# EAGLE design coyoho-camera (EAGLE 5.10)
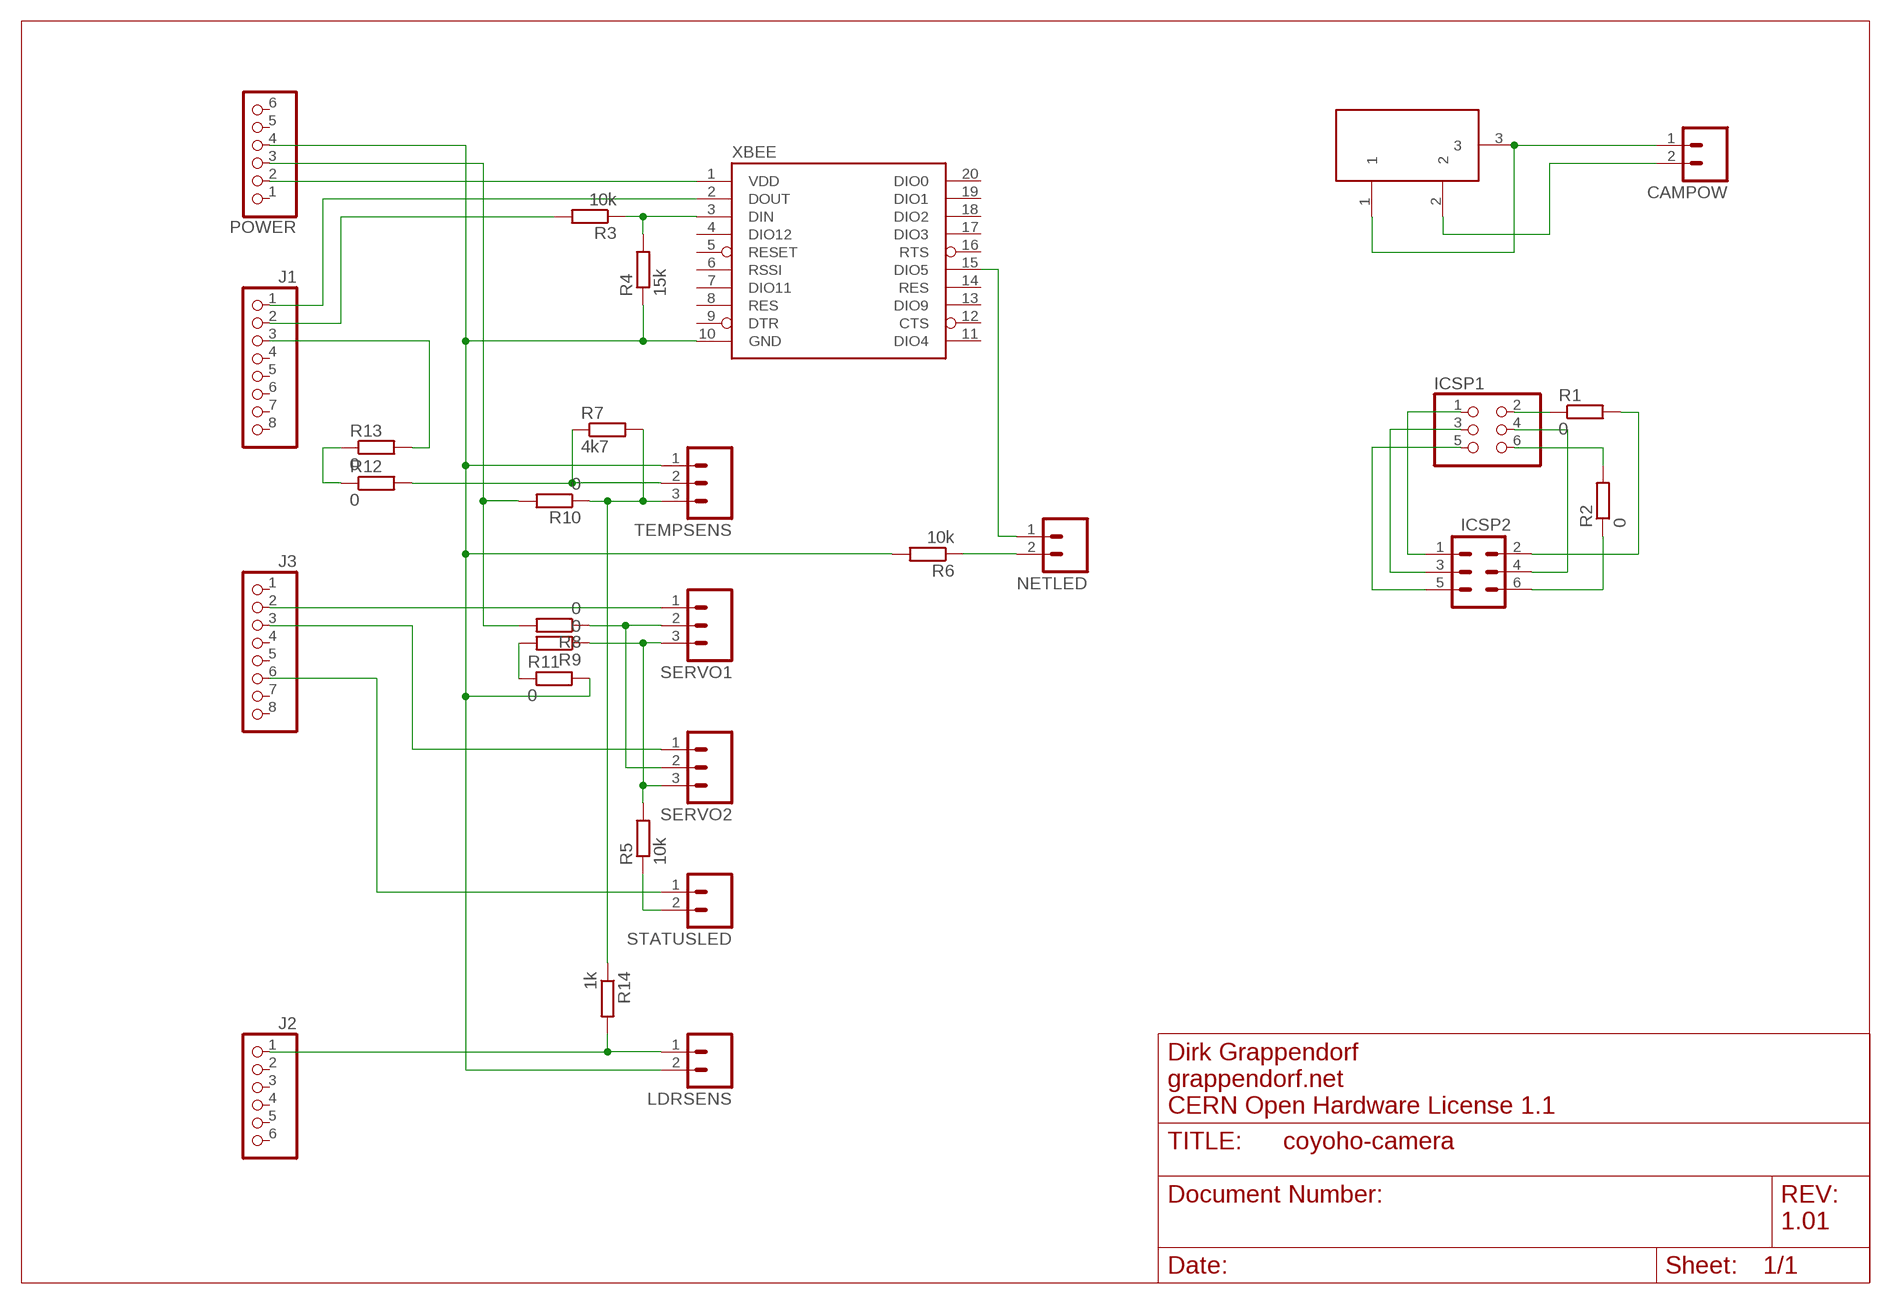
[diagram p0: schematic, sheet 1]

## Parts
CAMPOW  M02-74099  [74099-02]
ICSP1  PINHD-2X3  [2X03]
ICSP2  M03X2SHD_SMD  [2X5-SMD]
J1  PINHD-1X8  [1X08]
J2  PINHD-1X6  [1X06]
J3  PINHD-1X8  [1X08]
LDRSENS  M02-74099  [74099-02]
NETLED  M02-74099  [74099-02]
POWER  PINHD-1X6  [1X06]
R1  0  R-EU_M1206  [M1206]
R2  0  R-EU_M1206  [M1206]
R3  10k  R-EU_R1206  [R1206]
R4  15k  R-EU_R1206  [R1206]
R5  10k  R-EU_R1206  [R1206]
R6  10k  R-EU_R1206  [R1206]
R7  4k7  R-EU_R1206  [R1206]
R8  0  R-EU_M1206  [M1206]
R9  0  R-EU_M1206  [M1206]
R10  0  R-EU_M1206  [M1206]
R11  0  R-EU_M1206  [M1206]
R12  0  R-EU_M1206  [M1206]
R13  0  R-EU_M1206  [M1206]
R14  1k  R-EU_R1206  [R1206]
SERVO1  M03-74099  [74099-03]
SERVO2  M03-74099  [74099-03]
STATUSLED  M02-74099  [74099-02]
TEMPSENS  M03-74099  [74099-03]
X2  DC21MMX  [DC-21MM]
XBEE  XBEE-1B3  [XBEE-SMD]

## Nets
N$1: ICSP1.1 ICSP2.1
N$2: CAMPOW.2 X2.2
N$3: ICSP1.3 ICSP2.3
N$4: ICSP1.5 ICSP2.5
N$5: ICSP1.2 R1.1
N$6: ICSP1.4 ICSP2.4
N$7: ICSP1.6 R2.2
N$8: ICSP2.2 R1.2
N$9: ICSP2.6 R2.1
N$10: CAMPOW.1 X2.1 X2.3
N$11: J3.2 SERVO1.1
N$12: J3.3 SERVO2.1
N$13: POWER.3 R8.2 R10.2
N$14: LDRSENS.2 POWER.4 R4.1 R6.2 R11.2 TEMPSENS.1 XBEE.10(GND)
N$15: POWER.2 XBEE.1(VDD)
N$16: R3.1 R4.2 XBEE.3(DIN)
N$17: J1.2 R3.2
N$18: J1.1 XBEE.2(DOUT)
N$19: R5.1 STATUSLED.2
N$20: J3.6 STATUSLED.1
N$21: NETLED.2 R6.1
N$22: NETLED.1 XBEE.15(DIO5)
N$23: J1.3 R13.2
N$24: R5.2 R9.1 SERVO1.3 SERVO2.3
N$27: R8.1 SERVO1.2 SERVO2.2
N$28: R7.2 R10.1 R14.1 TEMPSENS.3
N$29: R9.2 R11.1
N$30: R12.1 R13.1
N$31: R7.1 R12.2 TEMPSENS.2
N$32: J2.1 LDRSENS.1 R14.2
Unconnected: J1.4 J1.5 J1.6 J1.7 J1.8 J2.2 J2.3 J2.4 J2.5 J2.6 J3.1 J3.4 J3.5 J3.7 J3.8 POWER.1 POWER.5 POWER.6 XBEE.4(DIO12) XBEE.5(RESET) XBEE.6(RSSI) XBEE.7(DIO11) XBEE.8(RES) XBEE.9(DTR) XBEE.11(DIO4) XBEE.12(CTS) XBEE.13(DIO9) XBEE.14(RES) XBEE.16(RTS) XBEE.17(DIO3) XBEE.18(DIO2) XBEE.19(DIO1) XBEE.20(DIO0)

## Notes on the sheet
- Dirk Grappendorf
- grappendorf.net
- CERN Open Hardware License 1.1
- 1.01

## Library data of the parts
CAMPOW LDRSENS NETLED STATUSLED = grapelabs:M02: CONNECTOR wire to board 2.54 mm (0.100") pitch header
ICSP1 = pinhead:PINHD-2X3: PIN HEADER
ICSP2 = grapelabs:M03X2: Header 5x2 Standard 10-pin dual row 0.1" header. Commonly used with AVR-ISP. Use with Spark Fun Electronics SKU: PRT-00778
J1 J3 = pinhead:PINHD-1X8: PIN HEADER
J2 POWER = pinhead:PINHD-1X6: PIN HEADER
R1-R14 = rcl:R-EU_: RESISTOR, European symbol
SERVO1 SERVO2 TEMPSENS = grapelabs:M03: CONNECTOR wire to board 2.54 mm (0.100") pitch header
X2 = powersupply:DC21MM
XBEE = SparkFun:XBEE-1

## Net classes
0 default: width 0.254 mm, drill 0.305 mm, clearance 0.152 mm
1 power: width 0.61 mm, drill 0.508 mm, clearance 0.152 mm
2 gnd: width 0.305 mm, drill 0.508 mm, clearance 0.152 mm
3 usbvcc: width 0.508 mm, drill 0.508 mm, clearance 0.152 mm
4 aref: width 0.406 mm

## Board
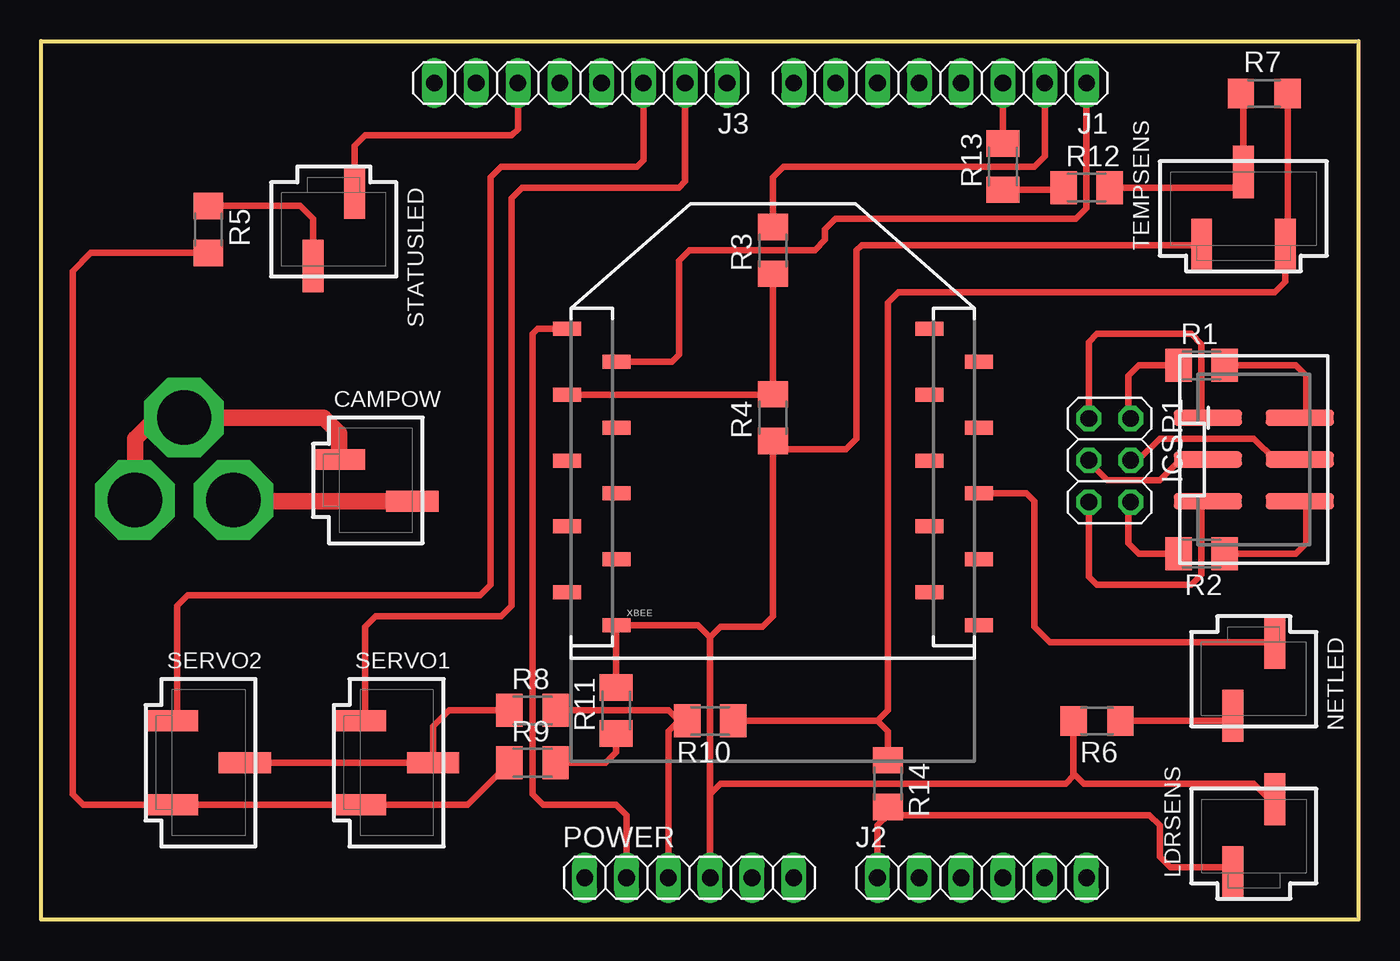
[diagram p1: board, top side]
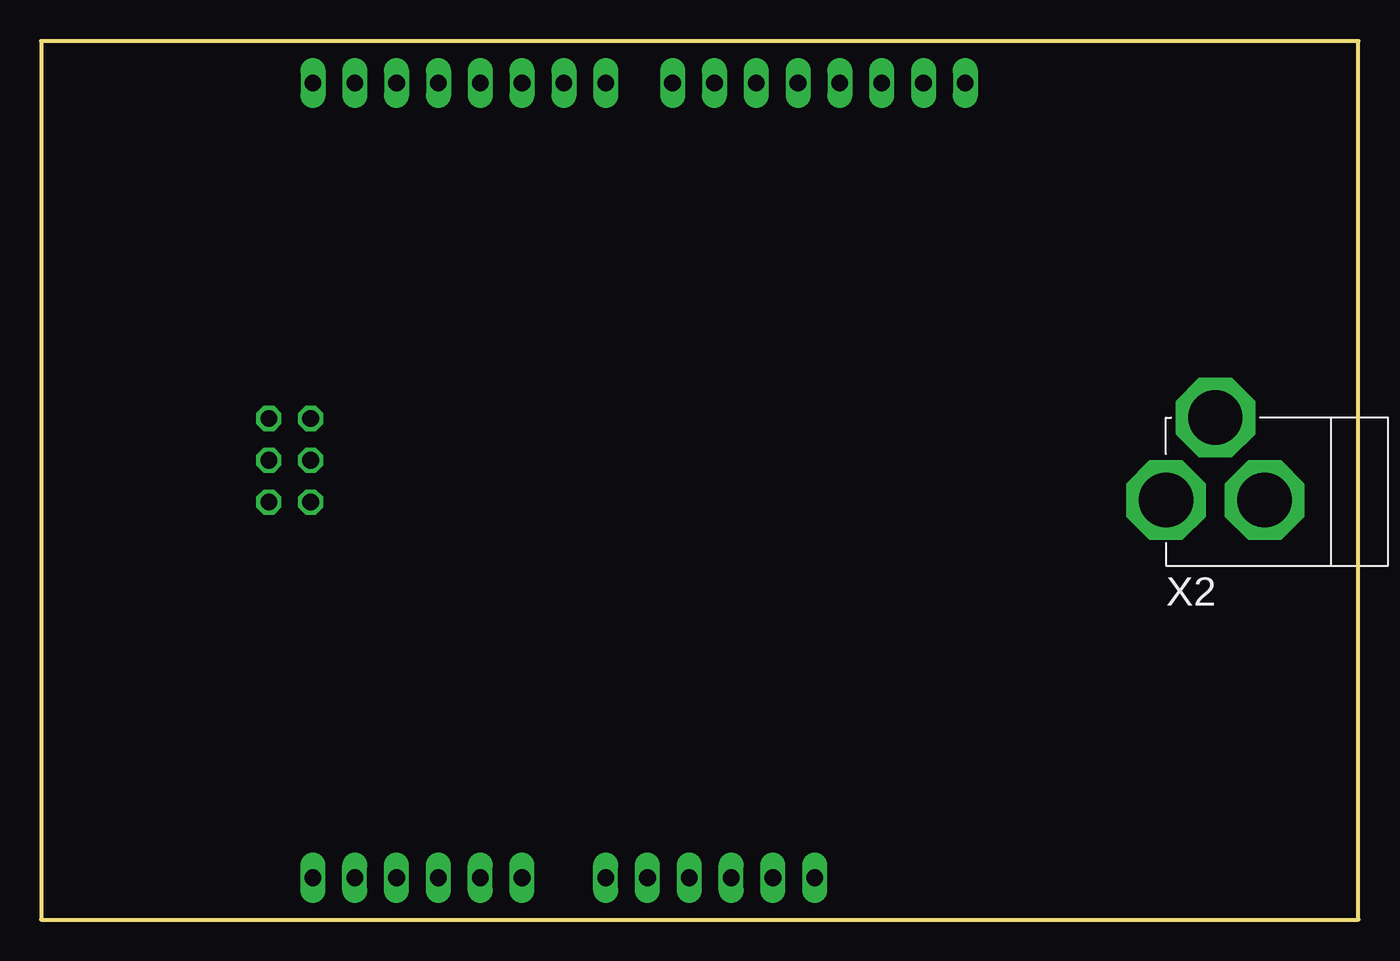
[diagram p2: board, bottom side, seen from below]

Size 80.01 x 53.34 mm. Coordinates in mm from the lower left corner, seen from the top.
Outline: 0,53.34 80.01,53.34 80.01,0 0,0 0,53.34
Copper layers (1*16): Top 0.035mm / dielectric 1.5mm / Bottom 0.035mm
Design rules "default *": minimum track width 6mil, minimum drill 12mil, track to track 6mil, track to pad 6mil, pad to pad 6mil, via to via 6mil, smd to smd 6mil, copper to edge 30mil, drill to drill 6mil, minimum pad ring 10mil, minimum via ring 10mil, stop-mask expansion 4mil, vias tented up to drill 0mil, thermal gap 10mil

### Footprints (pad centres in the part's own frame; a part is rotated, then mirrored left to right if it is on the bottom)
74099-02 = smd 1.27 x 3.175: 1 -2.54,-2.223; 2 0,2.223
2X03 = drill 1.016 octagon: 1 -2.54,-1.27; 2 -2.54,1.27; 3 0,-1.27; 4 0,1.27; 5 2.54,-1.27; 6 2.54,1.27
2X5-SMD = smd 4.15 x 1: 1 -2.794,2.54; 2 2.794,2.54; 3 -2.794,0; 4 2.794,0; 5 -2.794,-2.54; 6 2.794,-2.54
1X08 = drill 1.016 long: 1 -8.89,0; 2 -6.35,0; 3 -3.81,0; 4 -1.27,0; 5 1.27,0; 6 3.81,0; 7 6.35,0; 8 8.89,0
1X06 = drill 1.016 long: 1 -6.35,0; 2 -3.81,0; 3 -1.27,0; 4 1.27,0; 5 3.81,0; 6 6.35,0
M1206 = smd 1.6 x 2: 1 -1.4,0; 2 1.4,0
R1206 = smd 1.6 x 1.803: 1 -1.422,0; 2 1.422,0
74099-03 = smd 1.27 x 3.175: 1 -2.54,-2.223; 2 0,2.223; 3 2.54,-2.223
DC-21MM = drill 3.302 pad 4.826 octagon: 1 -5.08,-3.353; 2 -0.076,-6.35; 3 -0.076,-0.356
XBEE-SMD = smd 1.7 x 0.85: 1 -12.5,20; 2 -9.5,18; 3 -12.5,16; 4 -9.5,14; 5 -12.5,12; 6 -9.5,10; 7 -12.5,8; 8 -9.5,6; 9 -12.5,4; 10 -9.5,2; 11 12.5,2; 12 9.5,4; 13 12.5,6; 14 9.5,8; 15 12.5,10; 16 9.5,12; 17 12.5,14; 18 9.5,16; 19 12.5,18; 20 9.5,20

### Placement (x,y rotation side)
CAMPOW  20.32,25.4 270 top
ICSP1  64.91,27.89 270 top
ICSP2  73.66,27.94 0 top
J1  54.61,50.8 180 top
J2  57.15,2.54 0 top
J3  32.77,50.8 180 top
LDRSENS  74.93,5.08 0 top
NETLED  72.39,14.61 180 top
POWER  39.37,2.54 0 top
R1  70.48,33.66 0 top
R2  70.48,22.23 180 top
R3  44.45,40.64 90 top
R4  44.45,30.48 90 top
R5  10.16,41.91 270 top
R6  64.14,12.06 180 top
R7  74.3,50.16 0 top
R8  29.84,12.7 0 top
R9  29.84,9.53 0 top
R10  40.64,12.06 180 top
R11  34.92,12.7 90 top
R12  63.5,44.45 0 top
R13  58.42,45.72 90 top
R14  51.44,8.26 270 top
SERVO1  21.59,9.53 270 top
SERVO2  10.16,9.53 270 top
STATUSLED  16.51,41.91 180 top
TEMPSENS  73.03,43.18 0 top
X2  5.33,25.4 270 bottom
XBEE  44.45,15.88 0 top

### Tracks (layer width: path | path; a pad name or v marks a point on that pad's centre or on a via)
N$1
  Top 0.406: ICSP1.1 63.64,35.06 64.14,35.56 69.85,35.56 70.48,34.92 70.48,30.86 ICSP2.1
N$2
  Top 1.016: CAMPOW.2 11.76,25.4 X2.2
N$3
  Top 0.406: ICSP1.3 63.64,27.8 64.77,26.67 67.94,26.67 69.22,27.94 ICSP2.3
N$4
  Top 0.406: ICSP1.5 63.64,20.82 64.14,20.32 69.85,20.32 70.48,20.95 70.48,25.02 ICSP2.5
N$5
  Top 0.406: R1.1 66.67,33.66 66.04,33.02 66.04,30.57 ICSP1.2
N$6
  Top 0.406: ICSP1.4 66.62,27.89 67.94,29.21 73.66,29.21 74.93,27.94 ICSP2.4
N$7
  Top 0.406: R2.2 66.67,22.23 66.04,22.86 66.04,25.21 ICSP1.6
N$8
  Top 0.406: R1.2 76.2,33.66 76.83,33.02 76.83,30.86 ICSP2.2
N$9
  Top 0.406: R2.1 76.2,22.23 76.83,22.86 76.83,25.02 ICSP2.6
N$10
  Top 1.016: X2.3 5.71,25.5 5.71,29.21 6.99,30.48 X2.1 17.14,30.48 18.1,29.53 CAMPOW.1
N$11
  Top 0.406: J3.2 39.12,44.83 38.73,44.45 29.21,44.45 28.57,43.81 28.57,19.05 27.94,18.41 20.32,18.41 19.68,17.78 19.68,12.38 SERVO1.1
N$12
  Top 0.406: J3.3 36.58,46.1 36.2,45.72 27.94,45.72 27.3,45.09 27.3,20.32 26.67,19.68 8.89,19.68 8.26,19.05 8.26,12.38 SERVO2.1
N$13
  Top 0.406: 38.73,12.06 R10.2 | 38.73,12.06 38.1,11.43 POWER.3 | R8.2 38.1,12.7 38.73,12.06
N$14
  Top 0.406: POWER.4 40.64,7.62 | 40.64,7.62 40.64,17.14 | 40.64,17.14 39.91,17.88 XBEE.10 34.92,17.21 R11.2 | 40.64,17.14 41.27,17.78 43.81,17.78 44.45,18.41 R4.1 44.6,28.57 48.9,28.57 49.53,29.21 49.53,40.64 49.85,40.96 TEMPSENS.1 | 40.64,7.62 41.27,8.26 62.23,8.26 62.71,8.74 62.71,8.89 | 62.71,9.68 R6.2 62.71,8.89 | LDRSENS.2 74.61,7.3 73.66,8.26 63.35,8.26 62.71,8.89
N$15
  Top 0.406: XBEE.1 30.16,35.88 29.84,35.56 29.84,7.62 30.48,6.99 34.92,6.99 35.56,6.35 POWER.2
N$16
  Top 0.406: XBEE.3 44.42,31.88 R4.2 R3.1
N$17
  Top 0.406: R3.2 44.45,45.09 45.09,45.72 60.33,45.72 60.96,46.35 J1.2
N$18
  Top 0.406: XBEE.2 38.32,33.88 38.73,34.29 38.73,40.01 39.37,40.64 46.99,40.64 47.62,41.27 47.62,41.91 48.26,42.55 62.87,42.55 63.5,43.18 J1.1
N$19
  Top 0.406: R5.1 15.72,43.33 16.51,42.55 STATUSLED.2
N$20
  Top 0.406: J3.6 28.96,48.01 28.57,47.62 19.68,47.62 19.05,46.99 STATUSLED.1
N$21
  Top 0.406: R6.1 72.07,12.06 NETLED.2
N$22
  Top 0.406: NETLED.1 61.28,16.83 60.33,17.78 60.33,25.4 59.85,25.88 XBEE.15
N$23
  Top 0.406: R13.2 J1.3
N$24
  Top 0.406: R9.1 25.91,6.99 SERVO1.3 SERVO2.3 2.54,6.99 1.91,7.62 1.91,39.37 3.02,40.49 R5.2
N$27
  Top 0.406: R8.1 24.77,12.7 23.81,11.75 SERVO1.2 SERVO2.2
N$28
  Top 0.406: 50.8,12.06 51.44,12.7 51.44,37.47 52.07,38.1 74.93,38.1 75.56,38.73 TEMPSENS.3 75.72,41.11 R7.2 | R10.1 50.8,12.06 | R14.1 51.44,11.43 50.8,12.06
N$29
  Top 0.406: R9.2 34.29,9.53 34.92,10.16 R11.1
N$30
  Top 0.406: R13.1 61.97,44.32 R12.1
N$31
  Top 0.406: TEMPSENS.2 72.71,45.09 | TEMPSENS.2 73.03,50.01 R7.1 | R12.2 73.03,44.45 TEMPSENS.2
N$32
  Top 0.406: 51.44,6.35 R14.2 | 51.44,6.35 50.8,5.71 J2.1 | 51.44,6.35 67.31,6.35 67.94,5.71 67.94,3.81 68.58,3.17 72.07,3.17 LDRSENS.1